# Altium project uMultimeter_ExpBreadBoard.PrjPCB
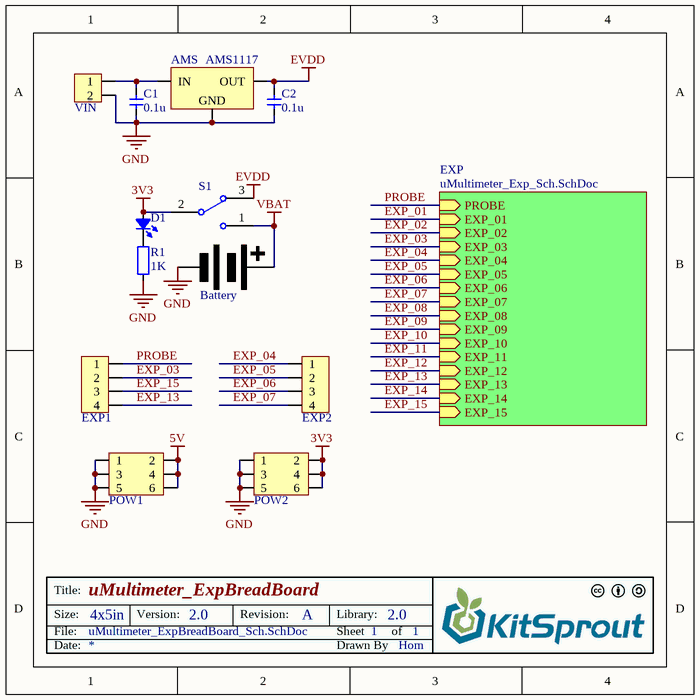
[diagram p0: uMultimeter_ExpBreadBoard_Sch.SchDoc]
2 sheets, 13 parts. Net scope: hierarchical (ports join the sheet entries above them; power ports are global).
Board file: uMultimeter_ExpBreadBoard_Pcb.PcbDoc
Sheets:
  uMultimeter_ExpBreadBoard_Sch.SchDoc
    EXP = uMultimeter_Exp_Sch.SchDoc

## Sheet uMultimeter_ExpBreadBoard_Sch.SchDoc: uMultimeter_ExpBreadBoard
size 127 x 127 mm; Author: Hom; CompanyName: KitSprout; DrawnBy: Hom; Engineer: Hom; Organization: KitSprout; Revision: A; SheetNumber: 1; SheetTotal: 1; License: CC BY-SA 4.0; Version: 2.0; LibVersion: 2.0; PageSetup: Record=PageOptions|CenterHorizontal=True|CenterVertical=True|PrintScale=1.00|XCorrection=1.00|YCorrection=1.00|PrintKind=0|BorderSize=5000000|LeftOffset=0|BottomOffset=0|Orientation=2|PaperLength=1000|PaperWidth=1000|Scale=100|PaperSource=7|PrintQuality=-3|MediaType=1|DitherType=10|PrintScaleMode=0|PaperKind=A4|PaperIndex=9

### Parts
AMS  AMS1117  [SOT223-3]
Battery  Battery  [CR2032-1]  (value not drawn)
C1  value 0.1u  [CAP_0603]  (hidden comment: Cap_0603)
C2  value 0.1u  [CAP_0603]  (hidden comment: Cap_0603)
D1  LED_0805  [LED_0805_BLUE]  (value not drawn)
EXP1  HDR1x4_2.54  [HDR1x4_2.54_180]  (value not drawn)
EXP2  HDR1x4_2.54  [HDR1x4_2.54_180]  (value not drawn)
POW1  HDR2x3_2.54  [HDR2X3_2.54_180]  (value not drawn)
POW2  HDR2x3_2.54  [HDR2X3_2.54_180]  (value not drawn)
R1  value 1K  [RES_0603]  (hidden comment: Res_0603)
S1  SwitchSPDT_2.8x6.6_90  [SwitchSPDT_2.8X6.6_90]  (value not drawn)
VIN  HDR1x2_2.54  [HDR1X2_2.54_90]  (value not drawn)

### Sub-sheets
EXP = uMultimeter_Exp_Sch.SchDoc: PROBE (in), EXP_01 (in), EXP_02 (in), EXP_03 (in), EXP_04 (in), EXP_05 (in), EXP_06 (in), EXP_07 (in), EXP_08 (in), EXP_09 (in), EXP_10 (in), EXP_11 (in), EXP_12 (in), EXP_13 (in), EXP_14 (in), EXP_15 (in)

### Nets
3V3: D1.1(A) POW2.2 POW2.4 POW2.6 S1.2
5V: POW1.2 POW1.4 POW1.6
EVDD: AMS.2(OUT) C2.2 S1.3
GND: AMS.1(GND) Battery.1(-) C1.1 C2.1 POW1.1 POW1.3 POW1.5 POW2.1 POW2.3 POW2.5 R1.2 VIN.2
VBAT: Battery.2(+) S1.1
EXP_03: EXP1.2 ; sheet EXP/EXP_03
EXP_04: EXP2.1 ; sheet EXP/EXP_04
EXP_05: EXP2.2 ; sheet EXP/EXP_05
EXP_06: EXP2.3 ; sheet EXP/EXP_06
EXP_07: EXP2.4 ; sheet EXP/EXP_07
EXP_13: EXP1.4 ; sheet EXP/EXP_13
EXP_15: EXP1.3 ; sheet EXP/EXP_15
PROBE: EXP1.1 ; sheet EXP/PROBE
NetAMS_3: AMS.3(IN) C1.2 VIN.1
NetD1_2: D1.2(K) R1.1

### Notes on the sheet
- Title:
- Size:
- Date:
- File:
- 4x5in
- Version:
- Revision:
- Sheet
- Drawn By
- Library:
- of

### Library data of the parts
AMS = AMS1117: Power
C1 C2 = Cap_0603: Capacitor
D1 = LED_0805: LED
EXP1 = HDR1x4_2.54T: Header
EXP2 = HDR1x4_2.54: Header
POW1 POW2 = HDR2x3_2.54: Header
R1 = Res_0603: Resistor
S1 = SwitchSPDT_2.8x6.6_90: Switch
VIN = HDR1x2_2.54T: Header

## Sheet uMultimeter_Exp_Sch.SchDoc: MicroMultimeter - EXP
size 127 x 101 mm; Author: Hom; CompanyName: KitSprout; DrawnBy: Hom; Engineer: Hom; Organization: KitSprout; Revision: A; SheetNumber: 1; SheetTotal: 1; License: CC BY-SA 4.0; Version: 2.0; LibVersion: 2.0; PageSetup: Record=PageOptions|CenterHorizontal=True|CenterVertical=True|PrintScale=1.00|XCorrection=1.00|YCorrection=1.00|PrintKind=0|BorderSize=5000000|LeftOffset=0|BottomOffset=0|Orientation=2|PaperLength=1000|PaperWidth=1000|Scale=100|PaperSource=7|PrintQuality=-3|MediaType=1|DitherType=10|PrintScaleMode=0|PaperKind=A4|PaperIndex=9
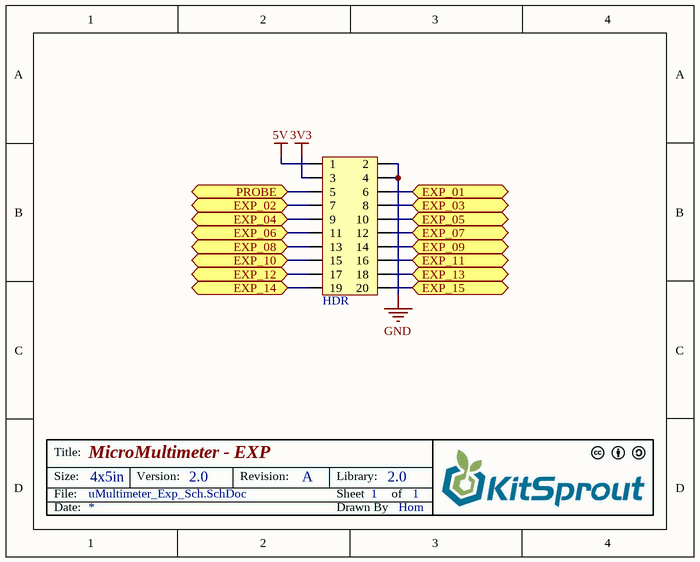
[diagram p1: uMultimeter_Exp_Sch.SchDoc]

### Parts
HDR  HDR2x10_2.54  [HDR2X10_2.54_180H]  (value not drawn)

### Ports
EXP_01, EXP_02, EXP_03, EXP_04, EXP_05, EXP_06, EXP_07, EXP_08, EXP_09, EXP_10, EXP_11, EXP_12, EXP_13, EXP_14, EXP_15, PROBE

### Nets
3V3: HDR.3
5V: HDR.1
GND: HDR.2 HDR.4
EXP_01: HDR.6 ; port EXP_01
EXP_02: HDR.7 ; port EXP_02
EXP_03: HDR.8 ; port EXP_03
EXP_04: HDR.9 ; port EXP_04
EXP_05: HDR.10 ; port EXP_05
EXP_06: HDR.11 ; port EXP_06
EXP_07: HDR.12 ; port EXP_07
EXP_08: HDR.13 ; port EXP_08
EXP_09: HDR.14 ; port EXP_09
EXP_10: HDR.15 ; port EXP_10
EXP_11: HDR.16 ; port EXP_11
EXP_12: HDR.17 ; port EXP_12
EXP_13: HDR.18 ; port EXP_13
EXP_14: HDR.19 ; port EXP_14
EXP_15: HDR.20 ; port EXP_15
PROBE: HDR.5 ; port PROBE

### Notes on the sheet
- Title:
- Size:
- Date:
- File:
- 4x5in
- Version:
- Revision:
- Sheet
- Drawn By
- Library:
- of

### Library data of the parts
HDR = HDR2x10_2.54: Header

## Nets that join several sheets
3V3: uMultimeter_ExpBreadBoard_Sch (5 pins), uMultimeter_Exp_Sch (HDR.3)
5V: uMultimeter_ExpBreadBoard_Sch (POW1.2 POW1.4 POW1.6), uMultimeter_Exp_Sch (HDR.1)
GND: uMultimeter_ExpBreadBoard_Sch (12 pins), uMultimeter_Exp_Sch (HDR.2 HDR.4)
EXP_03: uMultimeter_ExpBreadBoard_Sch (EXP1.2), uMultimeter_Exp_Sch (HDR.8)
EXP_04: uMultimeter_ExpBreadBoard_Sch (EXP2.1), uMultimeter_Exp_Sch (HDR.9)
EXP_05: uMultimeter_ExpBreadBoard_Sch (EXP2.2), uMultimeter_Exp_Sch (HDR.10)
EXP_06: uMultimeter_ExpBreadBoard_Sch (EXP2.3), uMultimeter_Exp_Sch (HDR.11)
EXP_07: uMultimeter_ExpBreadBoard_Sch (EXP2.4), uMultimeter_Exp_Sch (HDR.12)
EXP_13: uMultimeter_ExpBreadBoard_Sch (EXP1.4), uMultimeter_Exp_Sch (HDR.18)
EXP_15: uMultimeter_ExpBreadBoard_Sch (EXP1.3), uMultimeter_Exp_Sch (HDR.20)
PROBE: uMultimeter_ExpBreadBoard_Sch (EXP1.1), uMultimeter_Exp_Sch (HDR.5)